# Altium project PR406V1 - Sensores Plasma.PrjPcb
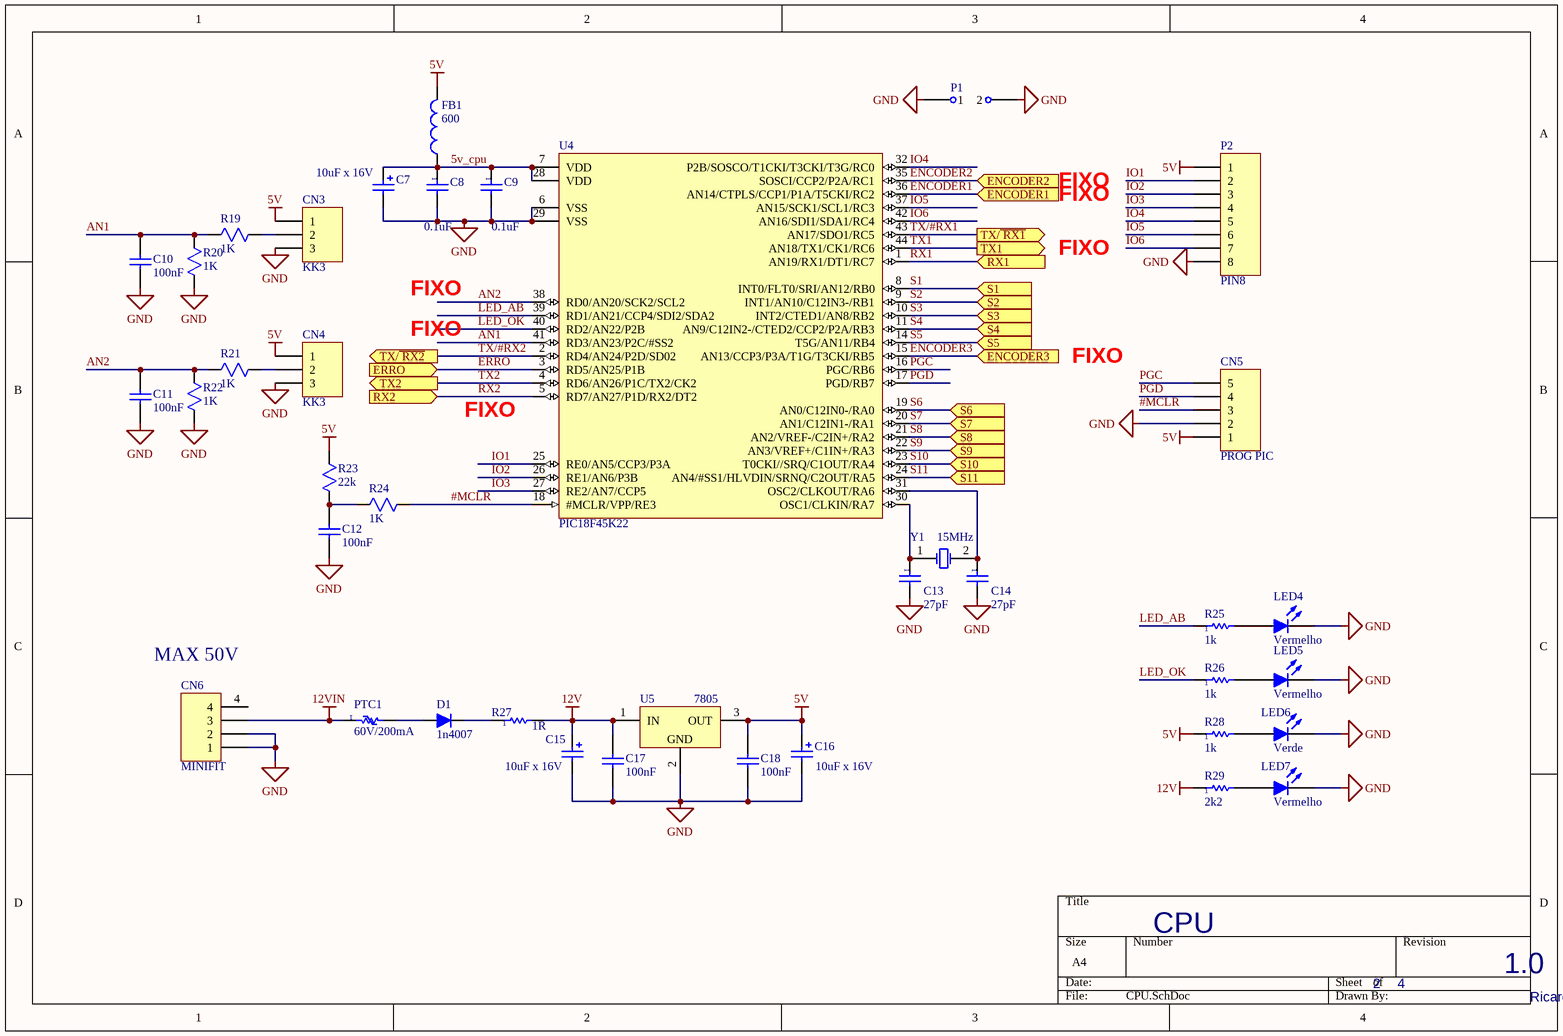
[diagram p0: CPU.SchDoc]
3 sheets, 143 parts. Net scope: flat (ports and power ports of the same name join across sheets).
Board file: PR406V1.PcbDoc
Sheets:
  CPU.SchDoc
  Sensores.SchDoc
  Comunicacao.SchDoc

## Sheet CPU.SchDoc
size A4; DocumentNumber: 2; SheetNumber: 2; SheetTotal: 4

### Parts
C7  10uF x 16V  [CapTant_SMD_A]
C8  0.1uF  [SMD_0805]
C9  0.1uF  [SMD_0805]
C10  100nF  [SMD0805C]
C11  100nF  [SMD0805C]
C12  100nF  [SMD0805C]
C13  27pF  [SMD_0805]
C14  27pF  [SMD_0805]
C15  10uF x 16V  [CapPol_SMD_C]
C16  10uF x 16V  [CapPol_SMD_C]
C17  100nF  [SMD0805C]
C18  100nF  [SMD0805C]
CN3  KK3  [KK3 - 2.54mm]
CN4  KK3  [KK3 - 2.54mm]
CN5  PROG PIC  [PROG PIC]
CN6  MINIFIT  [MFJRH4X1]
D1  1n4007  [DIODE-400]
FB1  600  [SMD_0805]
LED4  Vermelho  [LED_SMD_0805]
LED5  Vermelho  [LED_SMD_0805]
LED6  Verde  [LED_SMD_0805]
LED7  Vermelho  [LED_SMD_0805]
P1  JMP_2  [JMP_DIP2]  (value not drawn)
P2  PIN8  [PIN8]
PTC1  60V/200mA  [PTC-200]
R19  1K  [SMD0805]
R20  1K  [SMD0805]
R21  1K  [SMD0805]
R22  1K  [SMD0805]
R23  22k  [SMD0805]
R24  1K  [SMD0805]
R25  1k  [SMD_0805]
R26  1k  [SMD_0805]
R27  1R  [AXIAL-500]
R28  1k  [SMD_0805]
R29  2k2  [SMD_0805]
U4  PIC18F45K22  [QFP10X10-G44/Y1.8N]
U5  7805  [TO220_V]
Y1  15MHz  [CRYSTAL]

### Ports
ENCODER1 (in), ENCODER2 (in), ENCODER3 (in), ERRO (in), RX1 (in), RX2 (in), S1 (in), S2 (in), S3 (in), S4 (in), S5 (in), S6 (in), S7 (in), S8 (in), S9 (in), S10 (in), S11 (in), TX1 (out), TX2 (out), TX/~{ RX1} (out), TX/~{ RX2} (out)

### Nets
5V: C16.1 C18.1 CN3.1 CN4.1 CN5.1 FB1.2 P2.1 R23.1 R28.1 U5.3(OUT)
12V: C15.1 C17.1 R27.2 R29.1 U5.1(IN)
12VIN: CN6.3 PTC1.1
GND: C7.2 C8.2 C9.2 C10.2 C11.2 C12.2 C13.2 C14.2 C15.2 C16.2 C17.2 C18.2 CN3.3 CN4.3 CN5.2 CN6.1 CN6.2 LED4.2(K) LED5.2(K) LED6.2(K) LED7.2(K) P1.1 P1.2 P2.8 R20.1 R22.1 U4.6(VSS) U4.29(VSS) U5.2(GND)
5v_cpu: C7.1 C8.1 C9.1 FB1.1 U4.7(VDD) U4.28(VDD)
#MCLR: CN5.3 R24.2 U4.18(#MCLR/VPP/RE3)
AN1: C10.1 R19.1 R20.2 U4.41(RD3/AN23/P2C/#SS2)
AN2: C11.1 R21.1 R22.2 U4.38(RD0/AN20/SCK2/SCL2)
ENCODER1: U4.36(AN14/CTPLS/CCP1/P1A/T5CKI/RC2) ; port ENCODER1
ENCODER2: U4.35(SOSCI/CCP2/P2A/RC1) ; port ENCODER2
ENCODER3: U4.15(AN13/CCP3/P3A/T1G/T3CKI/RB5) ; port ENCODER3
ERRO: U4.3(RD5/AN25/P1B) ; port ERRO
IO1: P2.2 U4.25(RE0/AN5/CCP3/P3A)
IO2: P2.3 U4.26(RE1/AN6/P3B)
IO3: P2.4 U4.27(RE2/AN7/CCP5)
IO4: P2.5 U4.32(P2B/SOSCO/T1CKI/T3CKI/T3G/RC0)
IO5: P2.6 U4.37(AN15/SCK1/SCL1/RC3)
IO6: P2.7 U4.42(AN16/SDI1/SDA1/RC4)
LED_AB: R25.1 U4.39(RD1/AN21/CCP4/SDI2/SDA2)
LED_OK: R26.1 U4.40(RD2/AN22/P2B)
PGC: CN5.5 U4.16(PGC/RB6)
PGD: CN5.4 U4.17(PGD/RB7)
RX1: U4.1(AN19/RX1/DT1/RC7) ; port RX1
RX2: U4.5(RD7/AN27/P1D/RX2/DT2) ; port RX2
S1: U4.8(INT0/FLT0/SRI/AN12/RB0) ; port S1
S2: U4.9(INT1/AN10/C12IN3-/RB1) ; port S2
S3: U4.10(INT2/CTED1/AN8/RB2) ; port S3
S4: U4.11(AN9/C12IN2-/CTED2/CCP2/P2A/RB3) ; port S4
S5: U4.14(T5G/AN11/RB4) ; port S5
S6: U4.19(AN0/C12IN0-/RA0) ; port S6
S7: U4.20(AN1/C12IN1-/RA1) ; port S7
S8: U4.21(AN2/VREF-/C2IN+/RA2) ; port S8
S9: U4.22(AN3/VREF+/C1IN+/RA3) ; port S9
S10: U4.23(T0CKI//SRQ/C1OUT/RA4) ; port S10
S11: U4.24(AN4/#SS1/HLVDIN/SRNQ/C2OUT/RA5) ; port S11
TX1: U4.44(AN18/TX1/CK1/RC6) ; port TX1
TX2: U4.4(RD6/AN26/P1C/TX2/CK2) ; port TX2
TX/#RX1: U4.43(AN17/SDO1/RC5) ; port TX/~{ RX1}
TX/#RX2: U4.2(RD4/AN24/P2D/SD02) ; port TX/~{ RX2}
NetC12_1: C12.1 R23.2 R24.1
NetC13_1: C13.1 U4.30(OSC1/CLKIN/RA7) Y1.1(OSC1)
NetC14_1: C14.1 U4.31(OSC2/CLKOUT/RA6) Y1.2(OSC2)
NetCN3_2: CN3.2 R19.2
NetCN4_2: CN4.2 R21.2
NetD1_1: D1.1(K) R27.1
NetD1_2: D1.2(A) PTC1.2
NetLED4_1: LED4.1(A) R25.2
NetLED5_1: LED5.1(A) R26.2
NetLED6_1: LED6.1(A) R28.2
NetLED7_1: LED7.1(A) R29.2

Not connected (* = marked no-connect by the designer): CN6 4

### Notes on the sheet
- FIXO
- (near U4) FIXO
- (near CN6) MAX 50V
- CPU
- 2
- 4
- 1.0
- Ricardo Cardoso Felipe

### Library data of the parts
C7 C15 C16 = CapPol: Polarized Capacitor; Class I: Passive; Revision: July-2002: Re-released for DXP Platform.; Class II: Capacitor; Value: *
C8 C9 C13 C14 = Cap: Capacitor; Manufacturer: Generic Components; Class I: Passive; Revision: July-2002: Re-released for DXP Platform.; Class II: Capacitor; Value: *
C10-C12 C17 C18 = CAP: Capacitor
CN3 CN4 = KK3: Conector Linear tipo KK de 3 vias
CN5 = PROG PIC: Conector para gravação do PIC
CN6 = MINIFIT4: Conector minifit de 4 vias
D1 = Diodo: Diodos de diversos tamanhos; Manufacturer: Generic Components; Class I: Discrete; Class II: Diode - Switching; Published: 8-Jun-2000; Revision: July-2002: Re-released for DXP Platform.; Publisher: Altium Limited
FB1 = FerriteBead: Ferrite Bead Inductor; Class I: Passive; Revision: July-2002: Re-released for DXP Platform.; Class II: Inductor; Value: *
LED4-LED7 = Led: Manufacturer: Generic Components; Class I: Optoelectronic; Published: 8-Jun-2000; Revision: July-2002: Re-released for DXP Platform.; Publisher: Altium Limited; Class II: LED
P1 = JMP_2: Jumper 2 terminais; Manufacturer: Generic Components; Published: 24-Mar-1999; Revision: July-2002: Re-released for DXP Platform.; Publisher: Altium Limited
P2 = PIN8: Conector Linear
PTC1 = PTC: Termistor; Class I: Passive; Class II: Resistor; Revision: July-2002: Re-released for DXP Platform.; Value: *
R19-R24 = Resistor
R25-R29 = Res: Resistor; Class I: Passive; Revision: July-2002: Re-released for DXP Platform.; Class II: Resistor; Value: *
U4 = PIC18F45K22_SMD: Microcontrollers with nanoWatt XLP Technology; FirstPublished: 29-Jan-2009; LatestRevisionDate: 02-Dec-2009; LatestRevisionNote: Updated to datasheet revision F, Sep-2009; DatasheetVersion: revF, Sep-2009; PackageVersion: revBB, Aug-2009; PackageReference: PDIP600-P40; Publisher: Altium Limited; PackageDescription: 40-Lead Plastic Dual In-Line (P) - 600 mil Body [PDIP]; Supplier 1: Digi-Key; Supplier Part Number 1: PIC18F45K20-I/P-ND; Supplier 2: Farnell; Supplier Part Number 2: 1439588; Supplier 3: Newark; Supplier Part Number 3: 88K6041; ComponentLink1Description: Datasheet; ComponentLink1URL: http://ww1.microchip.com/downloads/en/DeviceDoc/41303F.pdf; ComponentLink2Description: Packaging Specification; ComponentLink2URL: http://www.microchip.com/stellent/groups/techpub_sg/documents/packagingspec/en012702.pdf; ComponentLink3Description: Microchip.com Home; ComponentLink3URL: http://www.microchip.com/
U5 = 78xx: Series 3-Terminal Positive Regulator; Manufacturer: National Semiconductor; Package Information: Latest Revision: 1995; Class I: Power Management; Class II: Voltage Regulator; Note: Tab is connected to GND; Published: 15-Apr-2002; Datasheet: Latest Revision: May-1999; Package Reference: T03B; Publisher: Altium Limited
Y1 = Cristal: Crystal Oscillator; Revision: July-2002: Re-released for DXP Platform.; Class I: Oscillator; Class II: Crystal Oscillator

## Sheet Sensores.SchDoc
size A4
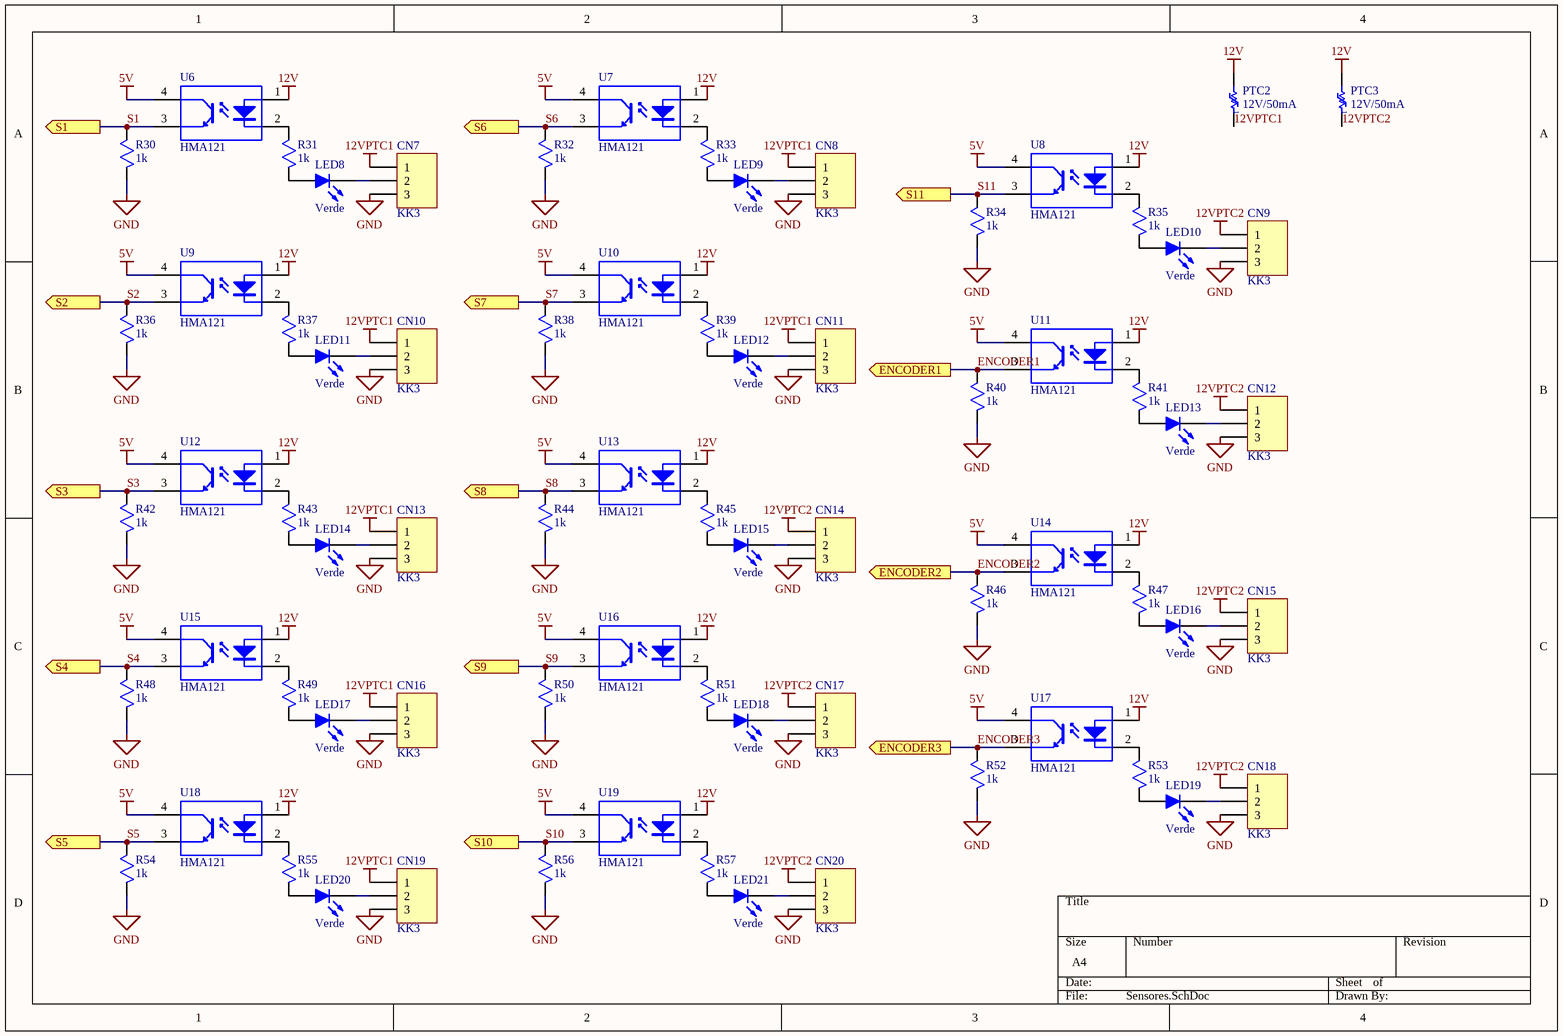
[diagram p1: Sensores.SchDoc]

### Parts
CN7  KK3  [KK3 - 2.54mm]
CN8  KK3  [KK3 - 2.54mm]
CN9  KK3  [KK3 - 2.54mm]
CN10  KK3  [KK3 - 2.54mm]
CN11  KK3  [KK3 - 2.54mm]
CN12  KK3  [KK3 - 2.54mm]
CN13  KK3  [KK3 - 2.54mm]
CN14  KK3  [KK3 - 2.54mm]
CN15  KK3  [KK3 - 2.54mm]
CN16  KK3  [KK3 - 2.54mm]
CN17  KK3  [KK3 - 2.54mm]
CN18  KK3  [KK3 - 2.54mm]
CN19  KK3  [KK3 - 2.54mm]
CN20  KK3  [KK3 - 2.54mm]
LED8  Verde  [LED_SMD_0805]
LED9  Verde  [LED_SMD_0805]
LED10  Verde  [LED_SMD_0805]
LED11  Verde  [LED_SMD_0805]
LED12  Verde  [LED_SMD_0805]
LED13  Verde  [LED_SMD_0805]
LED14  Verde  [LED_SMD_0805]
LED15  Verde  [LED_SMD_0805]
LED16  Verde  [LED_SMD_0805]
LED17  Verde  [LED_SMD_0805]
LED18  Verde  [LED_SMD_0805]
LED19  Verde  [LED_SMD_0805]
LED20  Verde  [LED_SMD_0805]
LED21  Verde  [LED_SMD_0805]
PTC2  12V/50mA  [PTC-200]
PTC3  12V/50mA  [PTC-200]
R30  1k  [SMD0805]
R31  1k  [SMD0805]
R32  1k  [SMD0805]
R33  1k  [SMD0805]
R34  1k  [SMD0805]
R35  1k  [SMD0805]
R36  1k  [SMD0805]
R37  1k  [SMD0805]
R38  1k  [SMD0805]
R39  1k  [SMD0805]
R40  1k  [SMD0805]
R41  1k  [SMD0805]
R42  1k  [SMD0805]
R43  1k  [SMD0805]
R44  1k  [SMD0805]
R45  1k  [SMD0805]
R46  1k  [SMD0805]
R47  1k  [SMD0805]
R48  1k  [SMD0805]
R49  1k  [SMD0805]
R50  1k  [SMD0805]
R51  1k  [SMD0805]
R52  1k  [SMD0805]
R53  1k  [SMD0805]
R54  1k  [SMD0805]
R55  1k  [SMD0805]
R56  1k  [SMD0805]
R57  1k  [SMD0805]
U6  HMA121  [SO4]
U7  HMA121  [SO4]
U8  HMA121  [SO4]
U9  HMA121  [SO4]
U10  HMA121  [SO4]
U11  HMA121  [SO4]
U12  HMA121  [SO4]
U13  HMA121  [SO4]
U14  HMA121  [SO4]
U15  HMA121  [SO4]
U16  HMA121  [SO4]
U17  HMA121  [SO4]
U18  HMA121  [SO4]
U19  HMA121  [SO4]

### Ports
ENCODER1 (out), ENCODER2 (out), ENCODER3 (out), S1 (out), S2 (out), S3 (out), S4 (out), S5 (out), S6 (out), S7 (out), S8 (out), S9 (out), S10 (out), S11 (out)

### Nets
5V: U6.4(C) U7.4(C) U8.4(C) U9.4(C) U10.4(C) U11.4(C) U12.4(C) U13.4(C) U14.4(C) U15.4(C) U16.4(C) U17.4(C) U18.4(C) U19.4(C)
12V: PTC2.2 PTC3.2 U6.1(A) U7.1(A) U8.1(A) U9.1(A) U10.1(A) U11.1(A) U12.1(A) U13.1(A) U14.1(A) U15.1(A) U16.1(A) U17.1(A) U18.1(A) U19.1(A)
12VPTC1: CN7.1 CN8.1 CN10.1 CN11.1 CN13.1 CN16.1 CN19.1 PTC2.1
12VPTC2: CN9.1 CN12.1 CN14.1 CN15.1 CN17.1 CN18.1 CN20.1 PTC3.1
GND: CN7.3 CN8.3 CN9.3 CN10.3 CN11.3 CN12.3 CN13.3 CN14.3 CN15.3 CN16.3 CN17.3 CN18.3 CN19.3 CN20.3 R30.2 R32.2 R34.2 R36.2 R38.2 R40.2 R42.2 R44.2 R46.2 R48.2 R50.2 R52.2 R54.2 R56.2
ENCODER1: R40.1 U11.3(E) ; port ENCODER1
ENCODER2: R46.1 U14.3(E) ; port ENCODER2
ENCODER3: R52.1 U17.3(E) ; port ENCODER3
S1: R30.1 U6.3(E) ; port S1
S2: R36.1 U9.3(E) ; port S2
S3: R42.1 U12.3(E) ; port S3
S4: R48.1 U15.3(E) ; port S4
S5: R54.1 U18.3(E) ; port S5
S6: R32.1 U7.3(E) ; port S6
S7: R38.1 U10.3(E) ; port S7
S8: R44.1 U13.3(E) ; port S8
S9: R50.1 U16.3(E) ; port S9
S10: R56.1 U19.3(E) ; port S10
S11: R34.1 U8.3(E) ; port S11
NetCN7_2: CN7.2 LED8.2(K)
NetCN8_2: CN8.2 LED9.2(K)
NetCN9_2: CN9.2 LED10.2(K)
NetCN10_2: CN10.2 LED11.2(K)
NetCN11_2: CN11.2 LED12.2(K)
NetCN12_2: CN12.2 LED13.2(K)
NetCN13_2: CN13.2 LED14.2(K)
NetCN14_2: CN14.2 LED15.2(K)
NetCN15_2: CN15.2 LED16.2(K)
NetCN16_2: CN16.2 LED17.2(K)
NetCN17_2: CN17.2 LED18.2(K)
NetCN18_2: CN18.2 LED19.2(K)
NetCN19_2: CN19.2 LED20.2(K)
NetCN20_2: CN20.2 LED21.2(K)
NetLED8_1: LED8.1(A) R31.1
NetLED9_1: LED9.1(A) R33.1
NetLED10_1: LED10.1(A) R35.1
NetLED11_1: LED11.1(A) R37.1
NetLED12_1: LED12.1(A) R39.1
NetLED13_1: LED13.1(A) R41.1
NetLED14_1: LED14.1(A) R43.1
NetLED15_1: LED15.1(A) R45.1
NetLED16_1: LED16.1(A) R47.1
NetLED17_1: LED17.1(A) R49.1
NetLED18_1: LED18.1(A) R51.1
NetLED19_1: LED19.1(A) R53.1
NetLED20_1: LED20.1(A) R55.1
NetLED21_1: LED21.1(A) R57.1
NetR31_2: R31.2 U6.2(K)
NetR33_2: R33.2 U7.2(K)
NetR35_2: R35.2 U8.2(K)
NetR37_2: R37.2 U9.2(K)
NetR39_2: R39.2 U10.2(K)
NetR41_2: R41.2 U11.2(K)
NetR43_2: R43.2 U12.2(K)
NetR45_2: R45.2 U13.2(K)
NetR47_2: R47.2 U14.2(K)
NetR49_2: R49.2 U15.2(K)
NetR51_2: R51.2 U16.2(K)
NetR53_2: R53.2 U17.2(K)
NetR55_2: R55.2 U18.2(K)
NetR57_2: R57.2 U19.2(K)

### Library data of the parts
CN7-CN20 = KK3: Conector Linear tipo KK de 3 vias
LED8-LED21 = Led: as LED4 on sheet CPU; Published: 8-Jun-2000; Revision: July-2002: Re-released for DXP Platform.; Publisher: Altium Limited; Class II: LED
PTC2 PTC3 = PTC: as PTC1 on sheet CPU; Revision: July-2002: Re-released for DXP Platform.; Value: *
R30-R57 = Resistor
U6-U19 = HMA: Phototransistor Optocoupler SMD full Pptch mini-flat type; Manufacturer: Generic Components; Class I: Optoelectronic; Published: 24-Mar-1999; Revision: July-2002: Re-released for DXP Platform.; Publisher: Altium Limited

## Sheet Comunicacao.SchDoc
size A4
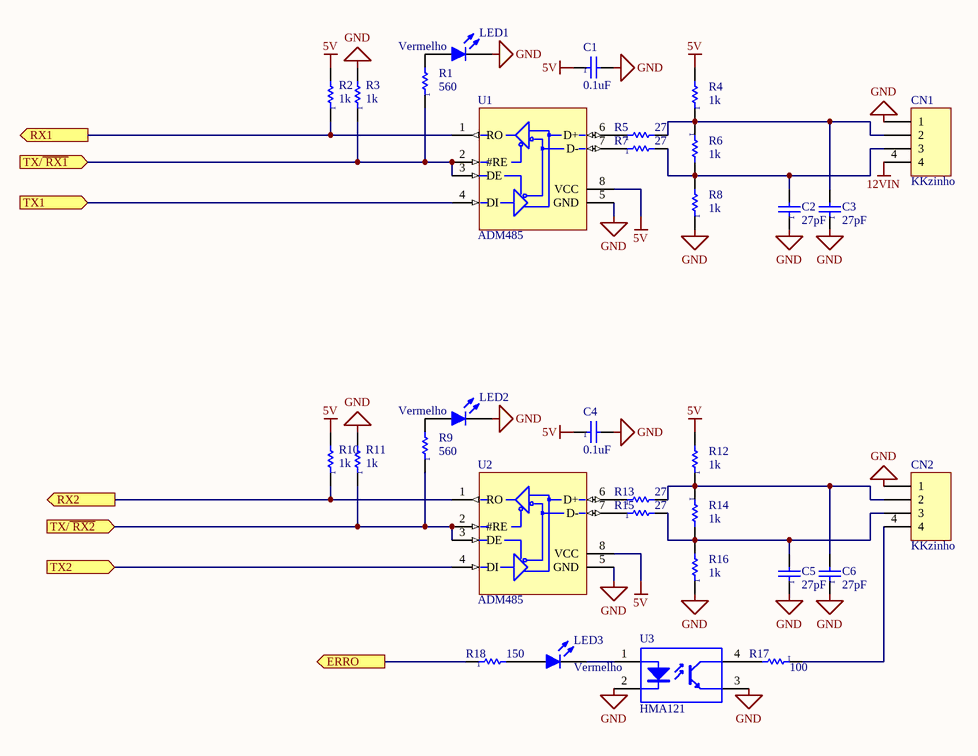
[diagram p2: Comunicacao.SchDoc]

### Parts
C1  0.1uF  [SMD_0805]
C2  27pF  [SMD_0805]
C3  27pF  [SMD_0805]
C4  0.1uF  [SMD_0805]
C5  27pF  [SMD_0805]
C6  27pF  [SMD_0805]
CN1  KKzinho  [KK4 - 2.54mm]
CN2  KKzinho  [KK4 - 2.54mm]
LED1  Vermelho  [LED_SMD_0805]
LED2  Vermelho  [LED_SMD_0805]
LED3  Vermelho  [LED_SMD_0805]
R1  560  [SMD_0805]
R2  1k  [SMD_0805]
R3  1k  [SMD_0805]
R4  1k  [SMD_0805]
R5  27  [SMD_0805]
R6  1k  [SMD_0805]
R7  27  [SMD_0805]
R8  1k  [SMD_0805]
R9  560  [SMD_0805]
R10  1k  [SMD_0805]
R11  1k  [SMD_0805]
R12  1k  [SMD_0805]
R13  27  [SMD_0805]
R14  1k  [SMD_0805]
R15  27  [SMD_0805]
R16  1k  [SMD_0805]
R17  100  [SMD_0805]
R18  150  [SMD_0805]
U1  ADM485  [SO-8_SO-G8/E2.5]
U2  ADM485  [SO-8_SO-G8/E2.5]
U3  HMA121  [SO4]

### Ports
ERRO (out), RX1 (out), RX2 (out), TX1 (in), TX2 (in), TX/~{ RX1} (in), TX/~{ RX2} (in)

### Nets
5V: C1.1 C4.1 R2.2 R4.2 R10.2 R12.2 U1.8(VCC) U2.8(VCC)
12VIN: CN1.4
GND: C1.2 C2.1 C3.1 C4.2 C5.1 C6.1 CN1.1 CN2.1 LED1.2(K) LED2.2(K) R3.2 R8.1 R11.2 R16.1 U1.5(GND) U2.5(GND) U3.2(K) U3.3(E)
ERRO: R18.1 ; port ERRO
RX1: R2.1 U1.1(RO) ; port RX1
RX2: R10.1 U2.1(RO) ; port RX2
TX1: U1.4(DI) ; port TX1
TX2: U2.4(DI) ; port TX2
TX/#RX1: R1.1 R3.1 U1.2(#RE) U1.3(DE) ; port TX/~{ RX1}
TX/#RX2: R9.1 R11.1 U2.2(#RE) U2.3(DE) ; port TX/~{ RX2}
NetC2_2: C2.2 CN1.3 R6.2 R7.2 R8.2
NetC3_2: C3.2 CN1.2 R4.1 R5.2 R6.1
NetC5_2: C5.2 CN2.3 R14.2 R15.2 R16.2
NetC6_2: C6.2 CN2.2 R12.1 R13.2 R14.1
NetCN2_4: CN2.4 R17.1
NetLED1_1: LED1.1(A) R1.2
NetLED2_1: LED2.1(A) R9.2
NetLED3_1: LED3.1(A) R18.2
NetLED3_2: LED3.2(K) U3.1(A)
NetR5_1: R5.1 U1.6(D+)
NetR7_1: R7.1 U1.7(D-)
NetR13_1: R13.1 U2.6(D+)
NetR15_1: R15.1 U2.7(D-)
NetR17_2: R17.2 U3.4(C)

### Library data of the parts
C1-C6 = Cap: as C8 on sheet CPU; Revision: July-2002: Re-released for DXP Platform.; Class II: Capacitor; Value: *
CN1 CN2 = KK4: Conector Linear tipo KK de 4 vias
LED1-LED3 = Led: as LED4 on sheet CPU; Published: 8-Jun-2000; Revision: July-2002: Re-released for DXP Platform.; Publisher: Altium Limited; Class II: LED
R1-R18 = Res: Resistor; Class I: Passive; Revision: July-2002: Re-released for DXP Platform.; Class II: Resistor; Value: *
U1 U2 = RS485: Differential bus transceiver (MAX485 - SN75176)
U3 = HMA: as U6 on sheet Sensores; Published: 24-Mar-1999; Revision: July-2002: Re-released for DXP Platform.; Publisher: Altium Limited

## Nets that join several sheets
5V: CPU (10 pins), Sensores (14 pins), Comunicacao (8 pins)
12V: CPU (5 pins), Sensores (16 pins)
12VIN: CPU (CN6.3 PTC1.1), Comunicacao (CN1.4)
GND: CPU (29 pins), Sensores (28 pins), Comunicacao (18 pins)
ENCODER1: CPU (U4.36), Sensores (R40.1 U11.3)
ENCODER2: CPU (U4.35), Sensores (R46.1 U14.3)
ENCODER3: CPU (U4.15), Sensores (R52.1 U17.3)
ERRO: CPU (U4.3), Comunicacao (R18.1)
RX1: CPU (U4.1), Comunicacao (R2.1 U1.1)
RX2: CPU (U4.5), Comunicacao (R10.1 U2.1)
S1: CPU (U4.8), Sensores (R30.1 U6.3)
S2: CPU (U4.9), Sensores (R36.1 U9.3)
S3: CPU (U4.10), Sensores (R42.1 U12.3)
S4: CPU (U4.11), Sensores (R48.1 U15.3)
S5: CPU (U4.14), Sensores (R54.1 U18.3)
S6: CPU (U4.19), Sensores (R32.1 U7.3)
S7: CPU (U4.20), Sensores (R38.1 U10.3)
S8: CPU (U4.21), Sensores (R44.1 U13.3)
S9: CPU (U4.22), Sensores (R50.1 U16.3)
S10: CPU (U4.23), Sensores (R56.1 U19.3)
S11: CPU (U4.24), Sensores (R34.1 U8.3)
TX1: CPU (U4.44), Comunicacao (U1.4)
TX2: CPU (U4.4), Comunicacao (U2.4)
TX/#RX1: CPU (U4.43), Comunicacao (R1.1 R3.1 U1.2 U1.3)
TX/#RX2: CPU (U4.2), Comunicacao (R9.1 R11.1 U2.2 U2.3)